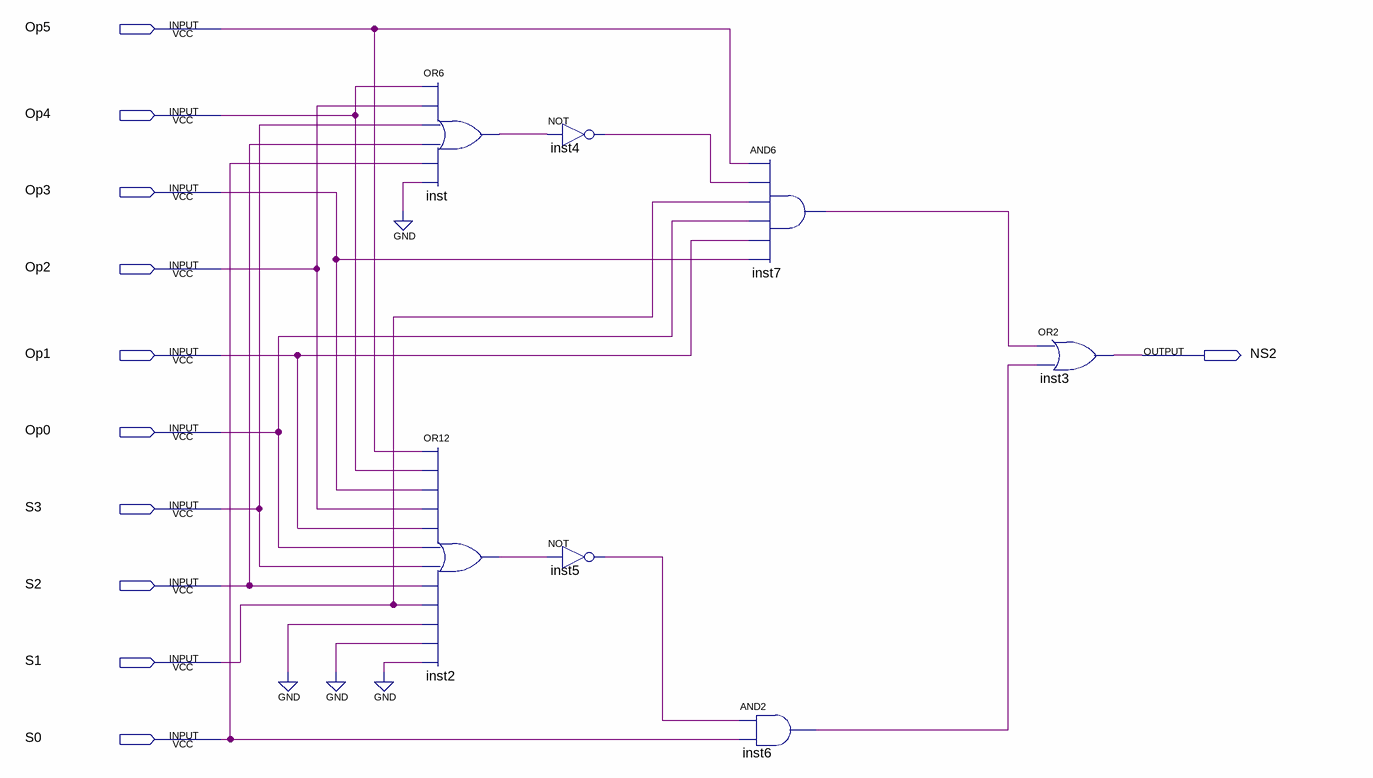
[diagram p0: schematic sheet]
// Quartus schematic NS2.bdf as structural Verilog: 7 symbols, 11 pins
module NS2 (
  input  Op5,
  input  Op4,
  input  Op3,
  input  Op2,
  input  Op1,
  input  Op0,
  input  S3,
  input  S2,
  input  S1,
  input  S0,
  output NS2
);

  wire inst2_out, inst4_out, inst5_out, inst6_out, inst7_out, inst_out;

  or inst (inst_out, Op4, Op2, S3, S2, S0, 1'b0);
  or inst2 (inst2_out, Op5, Op4, Op3, Op2, Op1, Op0, S3, S2, S1, 1'b0, 1'b0, 1'b0);
  not inst4 (inst4_out, inst_out);
  not inst5 (inst5_out, inst2_out);
  and inst7 (inst7_out, Op5, inst4_out, S1, Op0, Op1, Op3);
  and inst6 (inst6_out, inst5_out, S0);
  or inst3 (NS2, inst7_out, inst6_out);
endmodule
